# Altium schematic sheet ToF_Bottom.SchDoc
size A4; SheetNumber: 2; SheetTotal: 10
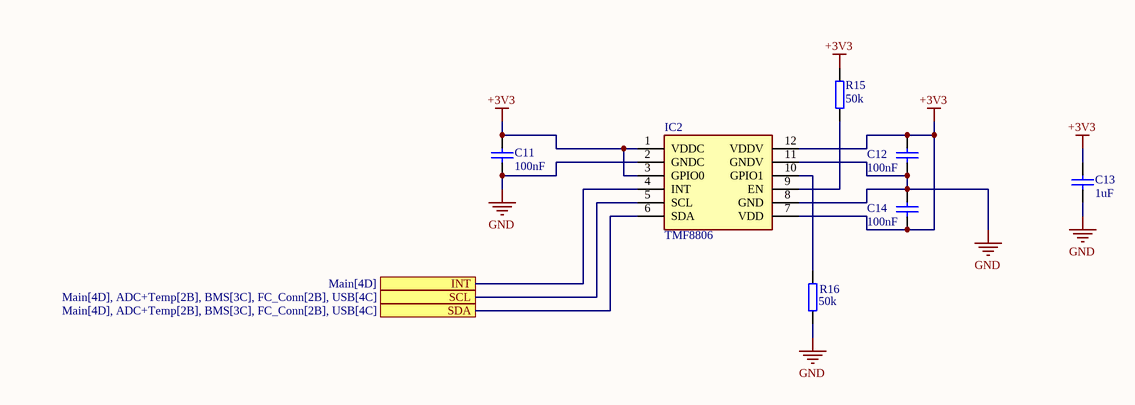
[diagram p0: ToF_Bottom.SchDoc]

## Parts
C11  value 100nF  [CAP0402]  (hidden comment: Cap0402)
C12  value 100nF  [CAP0402]  (hidden comment: Cap0402)
C13  value 1uF  [CAP0603]  (hidden comment: Cap0603)
C14  value 100nF  [CAP0402]  (hidden comment: Cap0402)
IC2  TMF8806  [TMF88051B]
R15  value 50k  [RES0402]  (hidden comment: Res0402)
R16  value 50k  [RES0402]  (hidden comment: Res0402)

## Ports
INT (see Main[4D]), SCL (see Main[4D], ADC+Temp[2B], BMS[3C], FC_Conn[2B], USB[4C]), SDA (see Main[4D], ADC+Temp[2B], BMS[3C], FC_Conn[2B], USB[4C])

## Nets
+3V3: C11.2 C12.2 C13.2 C14.1 IC2.1(VDDC) IC2.3(GPIO0) IC2.7(VDD) IC2.12(VDDV) R15.2
GND: C11.1 C12.1 C13.1 C14.2 IC2.2(GNDC) IC2.8(GND) IC2.11(GNDV) R16.1
INT: IC2.4(INT) ; port INT
SCL: IC2.5(SCL) ; port SCL
SDA: IC2.6(SDA) ; port SDA
NetIC2_9: IC2.9(EN) R15.1
NetIC2_10: IC2.10(GPIO1) R16.2

## Library data of the parts
C11 C12 C14 = Cap0402: Manufacturer_Part_Number: GRM155R71H104ME14D; Voltage: 50V
C13 = Cap0603: Manufacturer_Part_Number: GRT188R61H105KE13D; Voltage: 25V
IC2 = TMF8805-1B: Integrated Circuit; Manufacturer_Name: ams OSRAM; Datasheet Link: https://ams.com/documents/20143/4372629/TMF8805_DS000692_4-00.pdf; Height: 1.1mm; Manufacturer_Part_Number: TMF8805-1B; Mouser Part Number: 985-TMF8805-1B; Mouser Price/Stock: https://www.mouser.co.uk/ProductDetail/ams-OSRAM/TMF8805-1B?qs=sPbYRqrBIVlwsjHE%2F%252BrL9g%3D%3D
R15 R16 = Res0402: Manufacturer_Part_Number: TNPW040249K9DEED